# Altium schematic sheet RA-Manager_Relays.SchDoc
size A4
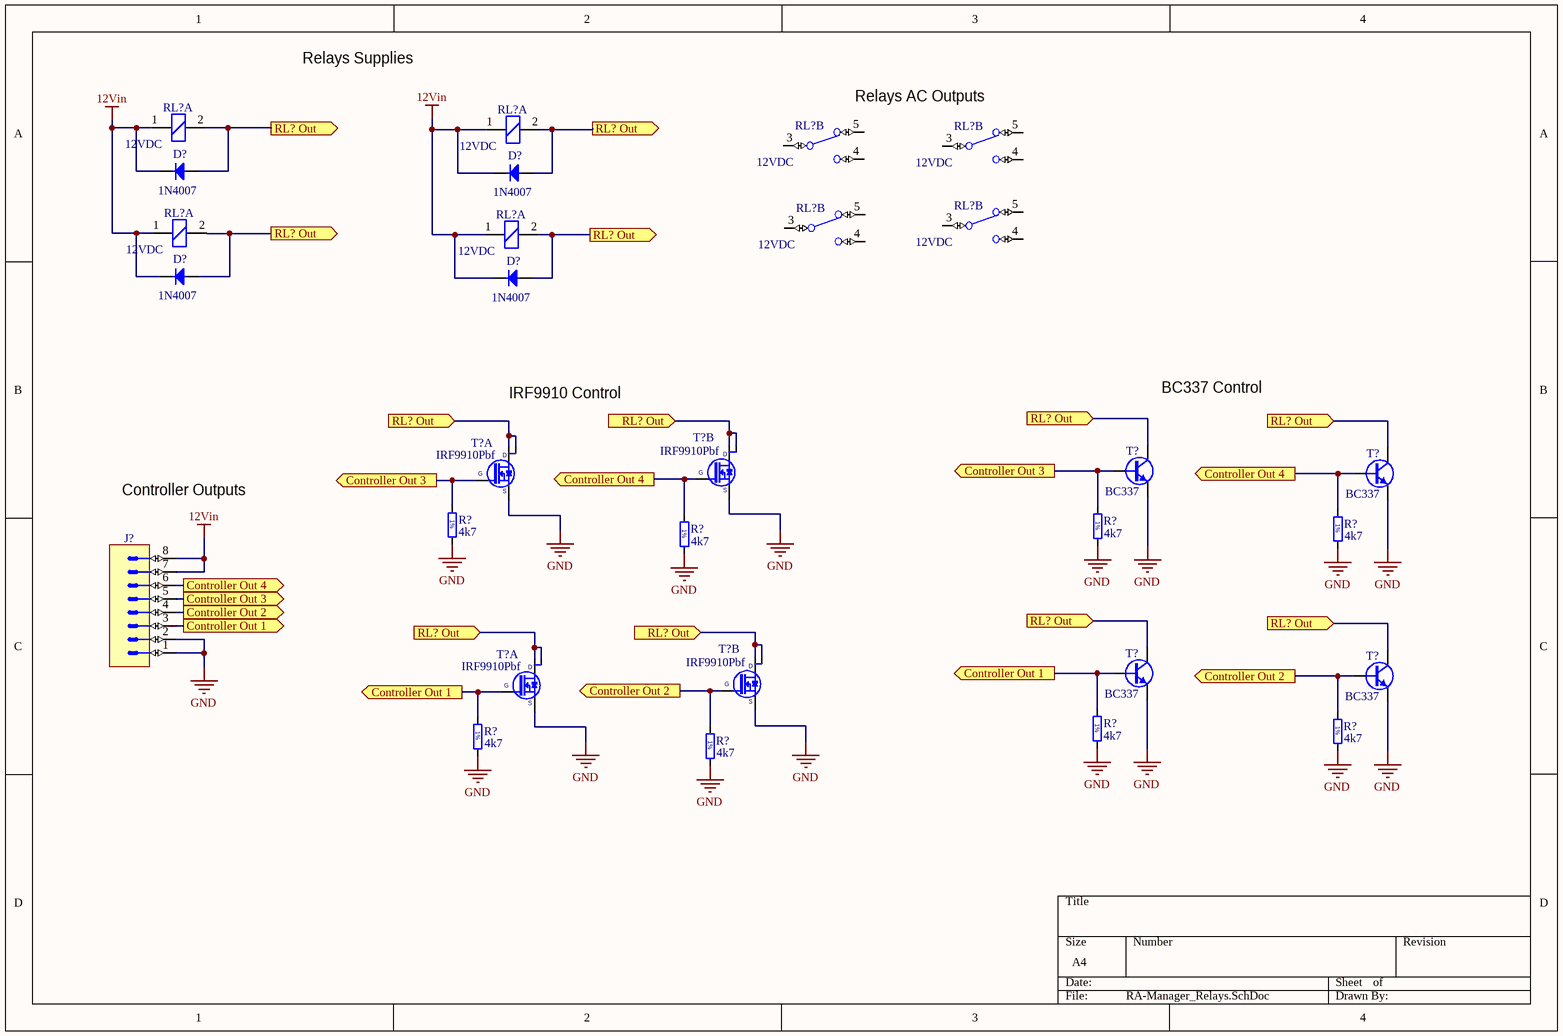
[diagram p0: RA-Manager_Relays.SchDoc]

## Parts
(Parts that share a designator on the sheet are numbered #1, #2 ... from top to bottom, then left to right.)
D?#1  1N4007  [DO-41]
D?#2  1N4007  [DO-41]
D?#3  1N4007  [DO-41]
D?#4  1N4007  [DO-41]
J?  (no value)  [HARWIN_D01-9922046_8OF20]
R?#1  4k7  [RESC1608X55N]
R?#2  4k7  [RESC1608X55N]
R?#3  4k7  [RESC1608X55N]
R?#4  4k7  [RESC1608X55N]
R?#5  4k7  [RESC1608X55N]
R?#6  4k7  [RESC1608X55N]
R?#7  4k7  [RESC1608X55N]
R?#8  4k7  [RESC1608X55N]
RL?#1  12VDC  [REL_IMO_SRM-1C]  (part A of 2)
RL?#2  12VDC  [REL_IMO_SRM-1C]  (part A of 2)
RL?#3  12VDC  [REL_IMO_SRM-1C]  (part B of 2)
RL?#4  12VDC  [REL_IMO_SRM-1C]  (part B of 2)
RL?#5  12VDC  [REL_IMO_SRM-1C]  (part B of 2)
RL?#6  12VDC  [REL_IMO_SRM-1C]  (part B of 2)
RL?#7  12VDC  [REL_IMO_SRM-1C]  (part A of 2)
RL?#8  12VDC  [REL_IMO_SRM-1C]  (part A of 2)
T?#1  BC337  [TO-92AA-P254]
T?#2  BC337  [TO-92AA-P254]
T?#3  IRF9910Pbf  [SOIC127P600X175-8N]  (part A of 2)
T?#4  IRF9910Pbf  [SOIC127P600X175-8N]  (part B of 2)
T?#5  BC337  [TO-92AA-P254]
T?#6  BC337  [TO-92AA-P254]
T?#7  IRF9910Pbf  [SOIC127P600X175-8N]  (part A of 2)
T?#8  IRF9910Pbf  [SOIC127P600X175-8N]  (part B of 2)

## Ports
Controller Out 1 (out), Controller Out 2 (out), Controller Out 3 (out), Controller Out 4 (out), RL? Out (in), RL? Out (out)

## Nets
12Vin: D?#1.1(C) D?#2.1(C) D?#3.1(C) D?#4.1(C) J?.7 J?.8 RL?#1.1(COIL) RL?#2.1(COIL) RL?#7.1(COIL) RL?#8.1(COIL)
GND: J?.1 J?.2 R?#1.2 R?#2.2 R?#3.2 R?#4.2 R?#5.2 R?#6.2 R?#7.2 R?#8.2 T?#1.3(E) T?#2.3(E) T?#3.3(S) T?#4.1(S) T?#5.3(E) T?#6.3(E) T?#7.3(S) T?#8.1(S)
Controller Out 1: J?.3 R?#5.1 R?#6.1 T?#5.2(B) T?#7.4(G) ; port Controller Out 1
Controller Out 2: J?.4 R?#7.1 R?#8.1 T?#6.2(B) T?#8.2(G) ; port Controller Out 2
Controller Out 3: J?.5 R?#1.1 R?#2.1 T?#1.2(B) T?#3.4(G) ; port Controller Out 3
Controller Out 4: J?.6 R?#3.1 R?#4.1 T?#2.2(B) T?#4.2(G) ; port Controller Out 4
RL? Out: D?#1.2(A) D?#2.2(A) D?#3.2(A) D?#4.2(A) RL?#1.2(COIL) RL?#2.2(COIL) RL?#7.2(COIL) RL?#8.2(COIL) T?#1.1(C) T?#2.1(C) T?#3.5(D) T?#3.6(D) T?#4.7(D) T?#4.8(D) T?#5.1(C) T?#6.1(C) T?#7.5(D) T?#7.6(D) T?#8.7(D) T?#8.8(D) ; port RL? Out

Not connected (* = marked no-connect by the designer): RL?#3 3(C) 4(NO) 5(NC); RL?#4 3(C) 4(NO) 5(NC); RL?#5 3(C) 4(NO) 5(NC); RL?#6 3(C) 4(NO) 5(NC)

## Notes on the sheet
- Relays Supplies
- (near RL?#4) Relays AC Outputs
- (near T?#3) IRF9910 Control
- BC337 Control
- Controller Outputs
- (in symbol R0603_4K7_1%_0.1W_100PPM) 1%

## Library data of the parts
D?#1-D?#4 = 1N4007: Diode; Part Description: Axial Lead Standard Recovery Rectifier; Manufacturer: FAIRCHILD SEMICONDUCTOR; Voltage: 1000V; Power: 1A; PressFit: No; Bonding: No; Part Number: 1N4007; Component Kind: Standard; Component Type: Standard; Device: 1N4007; PackageDescription: DO-41, Diode, Axial, Body 4.7 x 2.7mm (LxDia. Max), Pin spacing 10.16mm; Manufacturer Part Number: 1N4007; Pin Count: 2; Case: DO-41; Mounted: Yes; Socket: No; SMD: No; Sense: No; ComponentHeight: 2.72mm; HelpURL: \\cern.ch\dfs\Applications\Altium\Datasheets\1N4007.pdf; ComponentLink1URL: \\cern.ch\dfs\Applications\Altium\Datasheets\1N4007_Package.pdf; ComponentLink1Description: Package Drawing; Author: CERN DEM JLC; CreateDate: 20/08/2008; LatestRevisionDate: 30/10/2013
J? = HARWIN_D01-9922046_8OF20: Connector 8 Male; Part Description: 8 of 20 Contact 2.54mm Pitch Single-In-Line Header Strip -  Top Pin Ø0.46mm - Bottom Pin Ø0.69mm; Manufacturer: HARWIN; PressFit: No; Part Number: HARWIN_D01-9922046_8OF20; Component Kind: Standard; Component Type: Standard; Pin Count: 8; Mounted: Yes; Socket: No; SMD: No; Sense: No; Status: None; Manufacturer Part Number: D01-9922046; ComponentHeight: 7.43mm; HelpURL: \\cern.ch\dfs\Applications\Altium\Datasheets\HARWIN_D01-9922046.pdf; Author: CERN DEM JLC; CreateDate: 08/12/2008; LatestRevisionDate: 08/12/2008
R?#1-R?#8 = R0603_4K7_1%_0.1W_100PPM: Resistor - 1%; Part Description: General Purpose Thick Film Chip Resistor; Manufacturer: GENERIC; Manufacturer1 Part Number: NRC06F4701TRF; Power: 0.1W; TC: ±100ppm/°C; Part Number: R0603_4K7_1%_0.1W_100PPM; Component Kind: Standard; Component Type: Standard; Pin Count: 2; Value: 4k7; Status: Preferred; Tolerance: ±1%; Manufacturer Part Number: R0603_4K7_1%_0.1W_100PPM; Case: 0603; Mounted: Yes; Sense: No; Socket: No; SMD: Yes; Manufacturer1 Example: NIC COMPONENT; Manufacturer1 ComponentHeight: 0.55mm; HelpURL: \\cern.ch\dfs\Applications\Altium\Datasheets\R0603_NIC_NRC.pdf; Author: CERN DEM JLC; CreateDate: 03/12/2007; LatestRevisionDate: 13/03/2008
RL?#1-RL?#8 = REL_IMO_SRM-1C-SL-12VDC: 10A SPDT PCB Relay, SMR Serie; Part Description: 10A SPDT Power PCB Relay, SRM Series; Manufacturer: IMO; PressFit: No; Part Number: REL_IMO_SRM-1C-SL-12VDC; Component Kind: Standard; Component Type: Standard; Pin Count: 5; PackageDescription: 8 Leads, Row Spacing 12 mm; Body 19mm x 15.5mm, SRM Serie; Mounted: Yes; Socket: No; SMD: No; Sense: No; Status: None; Value: 12VDC; Manufacturer Part Number: SRM-1C-SL-12VDC; ComponentHeight: 15.5mm; HelpURL: \\cern.ch\dfs\Applications\Altium\Datasheets\REL_IMO_SRM.pdf; Author: CERN DEM JLC; CreateDate: 15/02/2011; LatestRevisionDate: 15/02/2011
T?#1 T?#2 T?#5 T?#6 = BC337: NPN Transistor; Part Description: 45V 800mA NPN Small Signal Transistor; Manufacturer: FAIRCHILD SEMICONDUCTOR; PressFit: No; Bonding: No; Part Number: BC337; Component Kind: Standard; Component Type: Standard; Device: BC337; PackageDescription: TO-92 (TO226), Pitch 2.54mm, Flat Index, 3 In-Line, Bent Leads, Body Dia. 5.3mm; Status: Obsolete; Manufacturer Part Number: BC337; Pin Count: 3; Case: TO-92; Mounted: Yes; Socket: No; SMD: No; Sense: No; ComponentHeight: 7.7mm; HelpURL: \\cern.ch\dfs\Applications\Altium\Datasheets\BC337.pdf; Author: CERN DEM JLC; CreateDate: 18/11/2008; LatestRevisionDate: 27/08/2014
T?#3 T?#4 T?#7 T?#8 = IRF9910Pbf: Dual SO-8 MOSFET For POL Cconverter; Part Description: 20V 10A(Q1) 20V 12A (Q2) Dual SO-8 MOSFET For POL Cconverter; Manufacturer: INTERNATIONAL RECTIFIER; PressFit: No; Bonding: No; Part Number: IRF9910Pbf; Component Kind: Standard; Component Type: Standard; Device: IRF9910Pbf; PackageDescription: SOIC 8, Pitch 1.27mm - Body 4x5mm, IPC Medium Density; Manufacturer Part Number: IRF9910Pbf; Pin Count: 8; Case: DO8; Mounted: Yes; Socket: No; SMD: Yes; Sense: No; ComponentHeight: 1.75mm; HelpURL: \\cern.ch\dfs\Applications\Altium\Datasheets\IRF9910Pbf.pdf; Author: CERN DEM JLC; CreateDate: 30/08/2010; LatestRevisionDate: 30/08/2010